# EAGLE design WCS MK2 v3 (EAGLE 7.5.0)
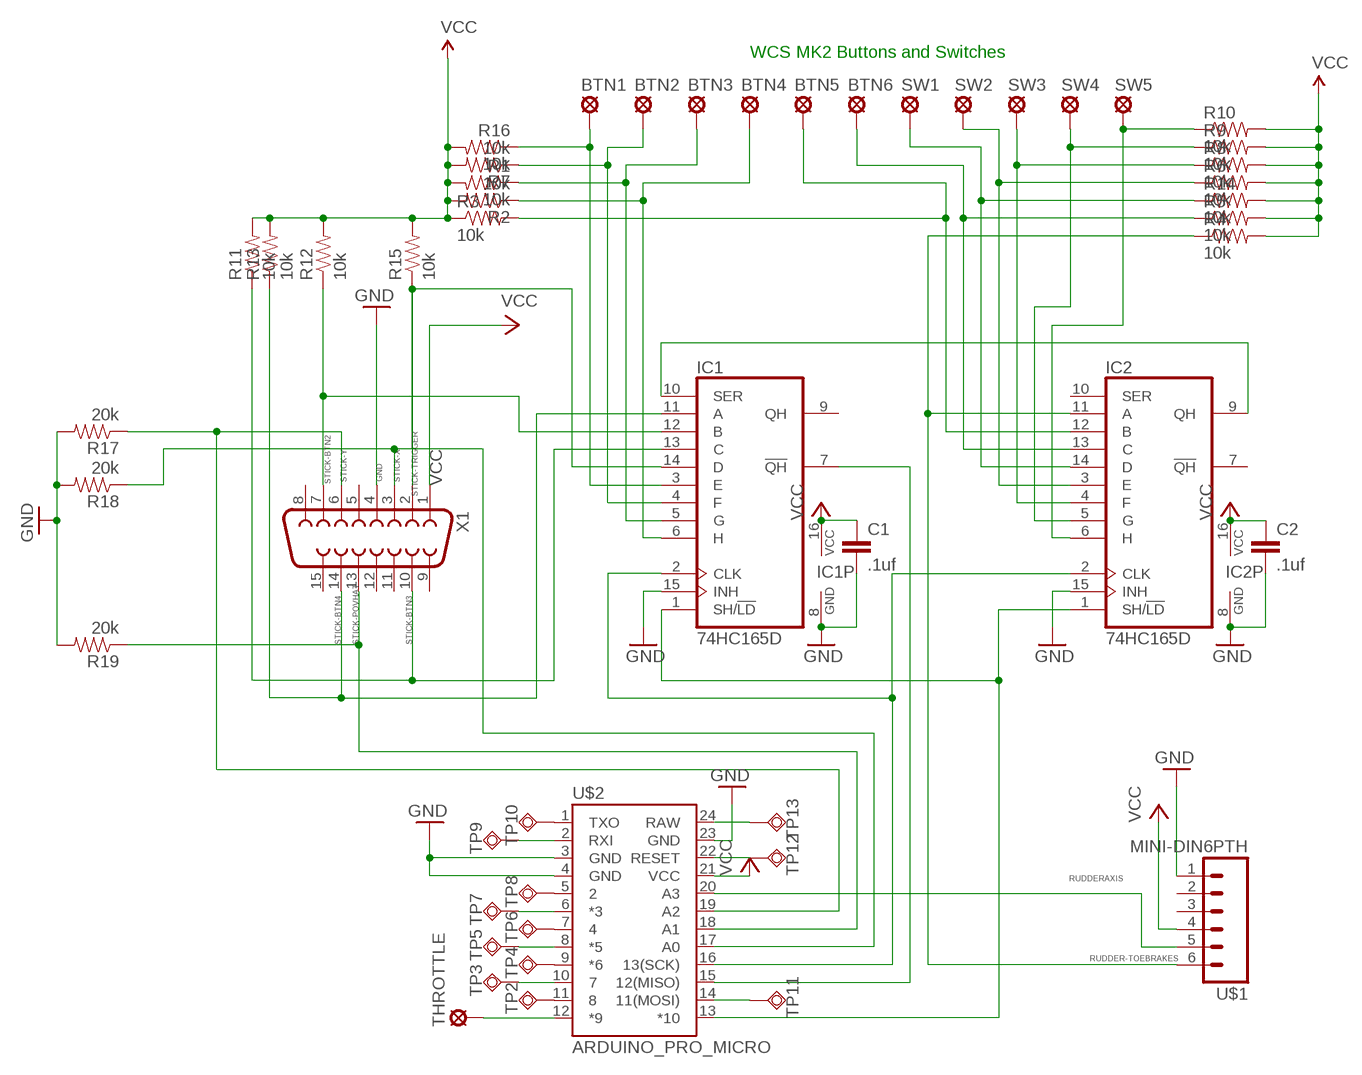
[diagram p0: schematic, sheet 1]

## Parts
BTN1  LSP10  [LSP10]
BTN2  LSP10  [LSP10]
BTN3  LSP10  [LSP10]
BTN4  LSP10  [LSP10]
BTN5  LSP10  [LSP10]
BTN6  LSP10  [LSP10]
C1  .1uf  C-EU025-060X050  [C025-060X050]
C2  .1uf  C-EU025-060X050  [C025-060X050]
IC1  74HC165D  [SO16]
IC2  74HC165D  [SO16]
R1  10k  10KOHM-1/4W5%(PTH)VERT  [AXIAL-0.1]
R2  10k  10KOHM-1/4W5%(PTH)VERT  [AXIAL-0.1]
R3  10k  10KOHM-1/4W5%(PTH)VERT  [AXIAL-0.1]
R4  10k  10KOHM-1/4W5%(PTH)VERT  [AXIAL-0.1]
R5  10k  10KOHM-1/4W5%(PTH)VERT  [AXIAL-0.1]
R6  10k  10KOHM-1/4W5%(PTH)VERT  [AXIAL-0.1]
R7  10k  10KOHM-1/4W5%(PTH)VERT  [AXIAL-0.1]
R8  10k  10KOHM-1/4W5%(PTH)VERT  [AXIAL-0.1]
R9  10k  10KOHM-1/4W5%(PTH)VERT  [AXIAL-0.1]
R10  10k  10KOHM-1/4W5%(PTH)VERT  [AXIAL-0.1]
R11  10k  10KOHM-1/4W5%(PTH)VERT  [AXIAL-0.1]
R12  10k  10KOHM-1/4W5%(PTH)VERT  [AXIAL-0.1]
R13  10k  10KOHM-1/4W5%(PTH)VERT  [AXIAL-0.1]
R14  10k  10KOHM-1/4W5%(PTH)VERT  [AXIAL-0.1]
R15  10k  10KOHM-1/4W5%(PTH)VERT  [AXIAL-0.1]
R16  10k  10KOHM-1/4W5%(PTH)VERT  [AXIAL-0.1]
R17  20k  10KOHM-1/4W5%(PTH)VERT  [AXIAL-0.1]
R18  20k  10KOHM-1/4W5%(PTH)VERT  [AXIAL-0.1]
R19  20k  10KOHM-1/4W5%(PTH)VERT  [AXIAL-0.1]
SW1  LSP10  [LSP10]
SW2  LSP10  [LSP10]
SW3  LSP10  [LSP10]
SW4  LSP10  [LSP10]
SW5  LSP10  [LSP10]
THROTTLE  LSP10  [LSP10]
TP2  TPSQTP20SQ  [TP20SQ]
TP3  TPSQTP20SQ  [TP20SQ]
TP4  TPSQTP20SQ  [TP20SQ]
TP5  TPSQTP20SQ  [TP20SQ]
TP6  TPSQTP20SQ  [TP20SQ]
TP7  TPSQTP20SQ  [TP20SQ]
TP8  TPSQTP20SQ  [TP20SQ]
TP9  TPSQTP20SQ  [TP20SQ]
TP10  TPSQTP20SQ  [TP20SQ]
TP11  TPSQTP20SQ  [TP20SQ]
TP12  TPSQTP20SQ  [TP20SQ]
TP13  TPSQTP20SQ  [TP20SQ]
U$1  MINI-DIN6PTH  [MINI-DIN6]
U$2  ARDUINO_PRO_MICRO  [ARDUINO_PRO_MICRO]
X1  F15HP  [F15HP]

## Nets
CLOCK: IC1.2(CLK) IC2.2(CLK) U$2.16(13(SCK))
DAISYCHAIN: IC1.10(SER) IC2.9(QH)
GND: C1.2 C2.2 IC1.8(GND) IC1.15(INH) IC2.8(GND) IC2.15(INH) R17.P$2 R18.P$2 R19.P$2 U$1.1 U$2.3(GND) U$2.4(GND) U$2.23(GND) X1.4
MISO: IC1.7(!QH) U$2.15(12(MISO))
N$13: BTN1.MP IC1.3(E) R16.P$1
N$14: BTN2.MP IC1.4(F) R7.P$1
N$15: BTN3.MP IC1.5(G) R1.P$1
N$16: BTN4.MP IC1.6(H) R2.P$1
N$17: IC2.6(H) R10.P$1 SW5.MP
N$18: IC2.5(G) R9.P$1 SW4.MP
N$19: IC2.4(F) R8.P$1 SW3.MP
N$20: IC2.3(E) R6.P$1 SW2.MP
N$21: IC2.14(D) R14.P$1 SW1.MP
N$22: BTN6.MP IC2.13(C) R5.P$1
N$23: BTN5.MP IC2.12(B) R3.P$2
N$28: TP2.TP U$2.11
N$29: TP3.TP U$2.10
N$30: TP4.TP U$2.9(*6)
N$31: TP5.TP U$2.8(*5)
N$32: TP6.TP U$2.7
N$33: TP7.TP U$2.6(*3)
N$34: TP8.TP U$2.5
N$35: TP9.TP U$2.2(RXI)
N$36: TP10.TP U$2.1(TXO)
N$37: TP11.TP U$2.14(11(MOSI))
N$38: TP12.TP U$2.22(RESET)
N$39: TP13.TP U$2.24(RAW)
RUDDER-TOEBRAKES: IC2.11(A) R4.P$1 U$1.6
RUDDERAXIS: U$1.5 U$2.20(A3)
SR-LOAD: IC1.1(SH/!LD) IC2.1(SH/!LD) U$2.13(*10)
STICK-BTN2: IC1.12(B) R12.P$1 X1.7
STICK-BTN3: IC1.13(C) R11.P$1 X1.10
STICK-BTN4: IC1.11(A) R13.P$1 X1.14
STICK-POVHAT: R19.P$1 U$2.18(A1) X1.13
STICK-TRIGGER: IC1.14(D) R15.P$1 X1.2
STICK-X: R18.P$1 U$2.17(A0) X1.3
STICK-Y: R17.P$1 U$2.19(A2) X1.6
THROTTLEAXIS: THROTTLE.MP U$2.12(*9)
VCC: C1.1 C2.1 IC1.16(VCC) IC2.16(VCC) R1.P$2 R2.P$2 R3.P$1 R4.P$2 R5.P$2 R6.P$2 R7.P$2 R8.P$2 R9.P$2 R10.P$2 R11.P$2 R12.P$2 R13.P$2 R14.P$2 R15.P$2 R16.P$2 U$1.4 U$2.21(VCC) X1.1
Unconnected: IC1.9(QH) IC2.7(!QH) IC2.10(SER) U$1.2 U$1.3 X1.5 X1.8 X1.9 X1.11 X1.12 X1.15

## Notes on the sheet
- WCS MK2 Buttons and Switches

## Library data of the parts
BTN1-BTN6 SW1-SW5 THROTTLE = solpad:LSP10: SOLDER PAD drill 1.0 mm, distributor Buerklin, 12H555
C1 C2 = resistor:C-EU: CAPACITOR, European symbol
IC1 IC2 = 74xx-eu:74*165: 8-bit parallel load SHIFT REGISTER
R1-R16 = SparkFun-Resistors:10KOHM-1/4W5%(PTH): RES-09435; PROD_ID: RES-9435
R17-R19 = SparkFun-Resistors:10KOHM-1/4W5%(PTH): RES-09435; PROD_ID: RES-9435; VALUE: 10k
TP2-TP13 = testpad:TPSQ: Test pad
U$1 = SparkFun-Connectors:MINI-DIN6: mini DIN 6 Connector Commonly found on the back of a computer for PS2 keyboard and mice. Schematic and footprint are proven. Spark Fun Electronics SKU : PRT-08509
U$2 = SparkFun-Boards:ARDUINO_PRO_MICRO
X1 = con-subd:F15: SUB-D; OC_FARNELL: unknown; OC_NEWARK: unknown

## Board
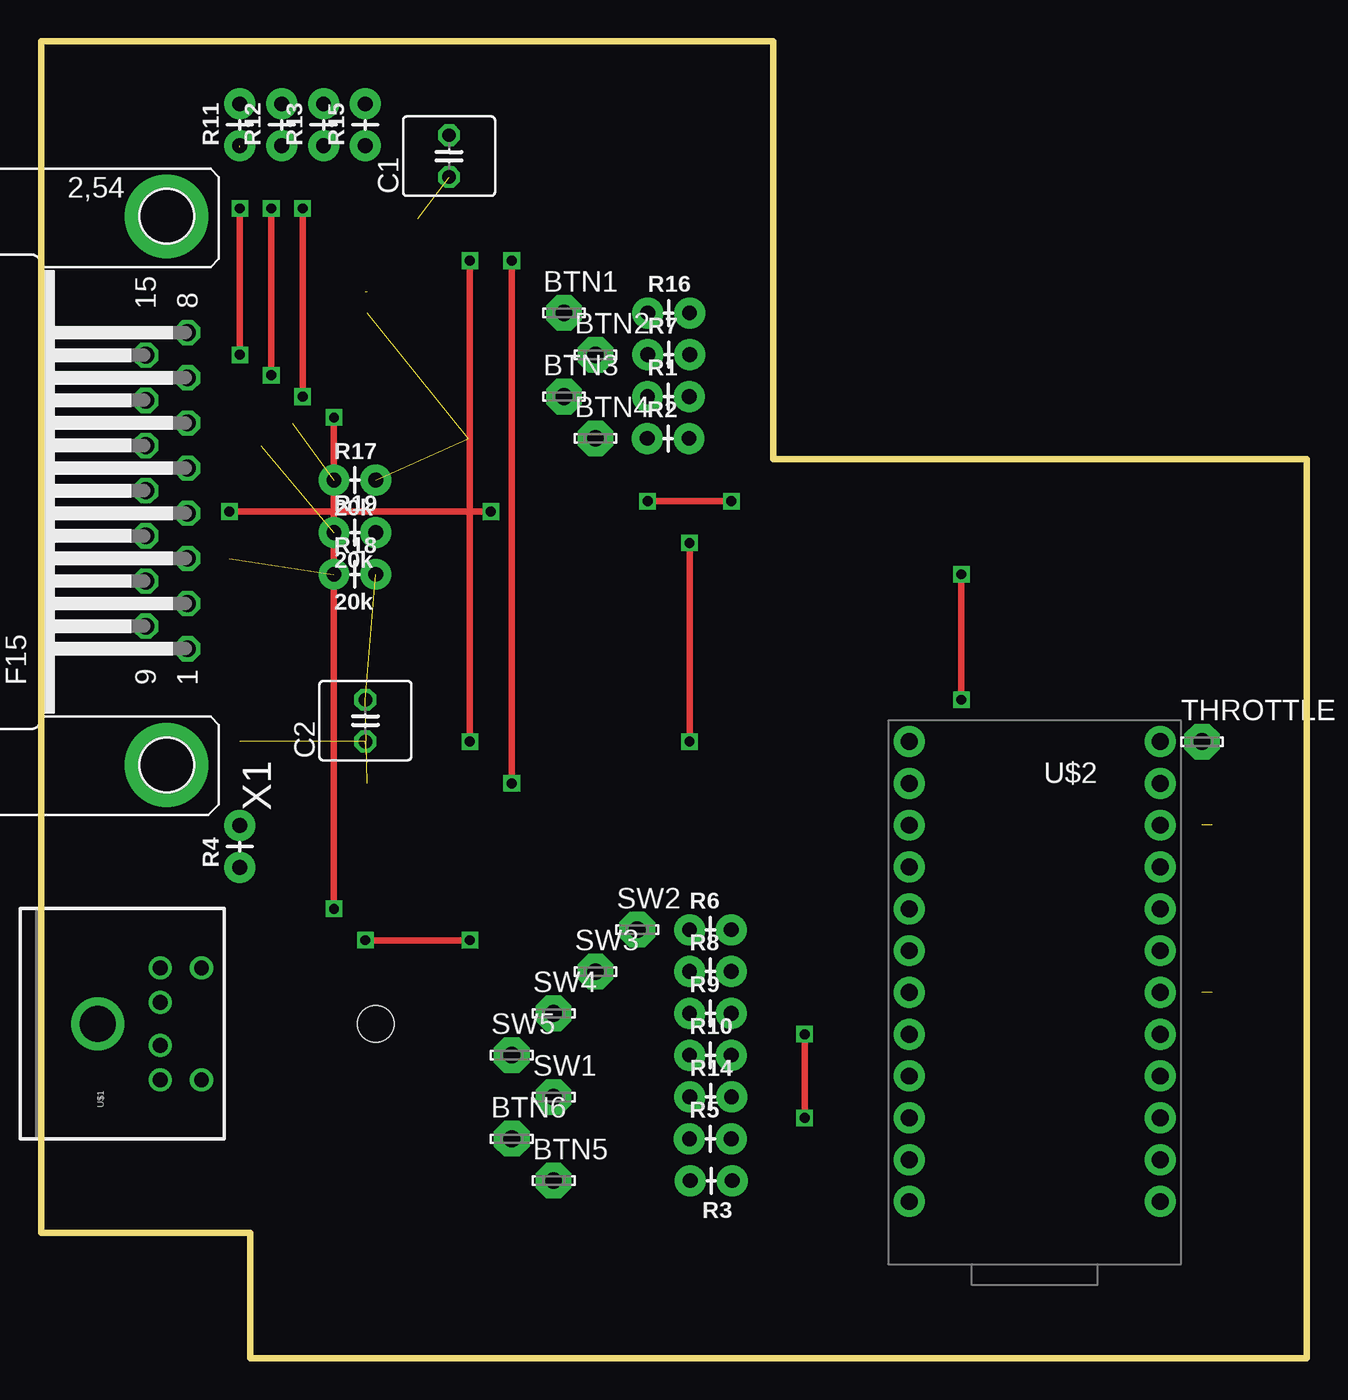
[diagram p1: board, top side]
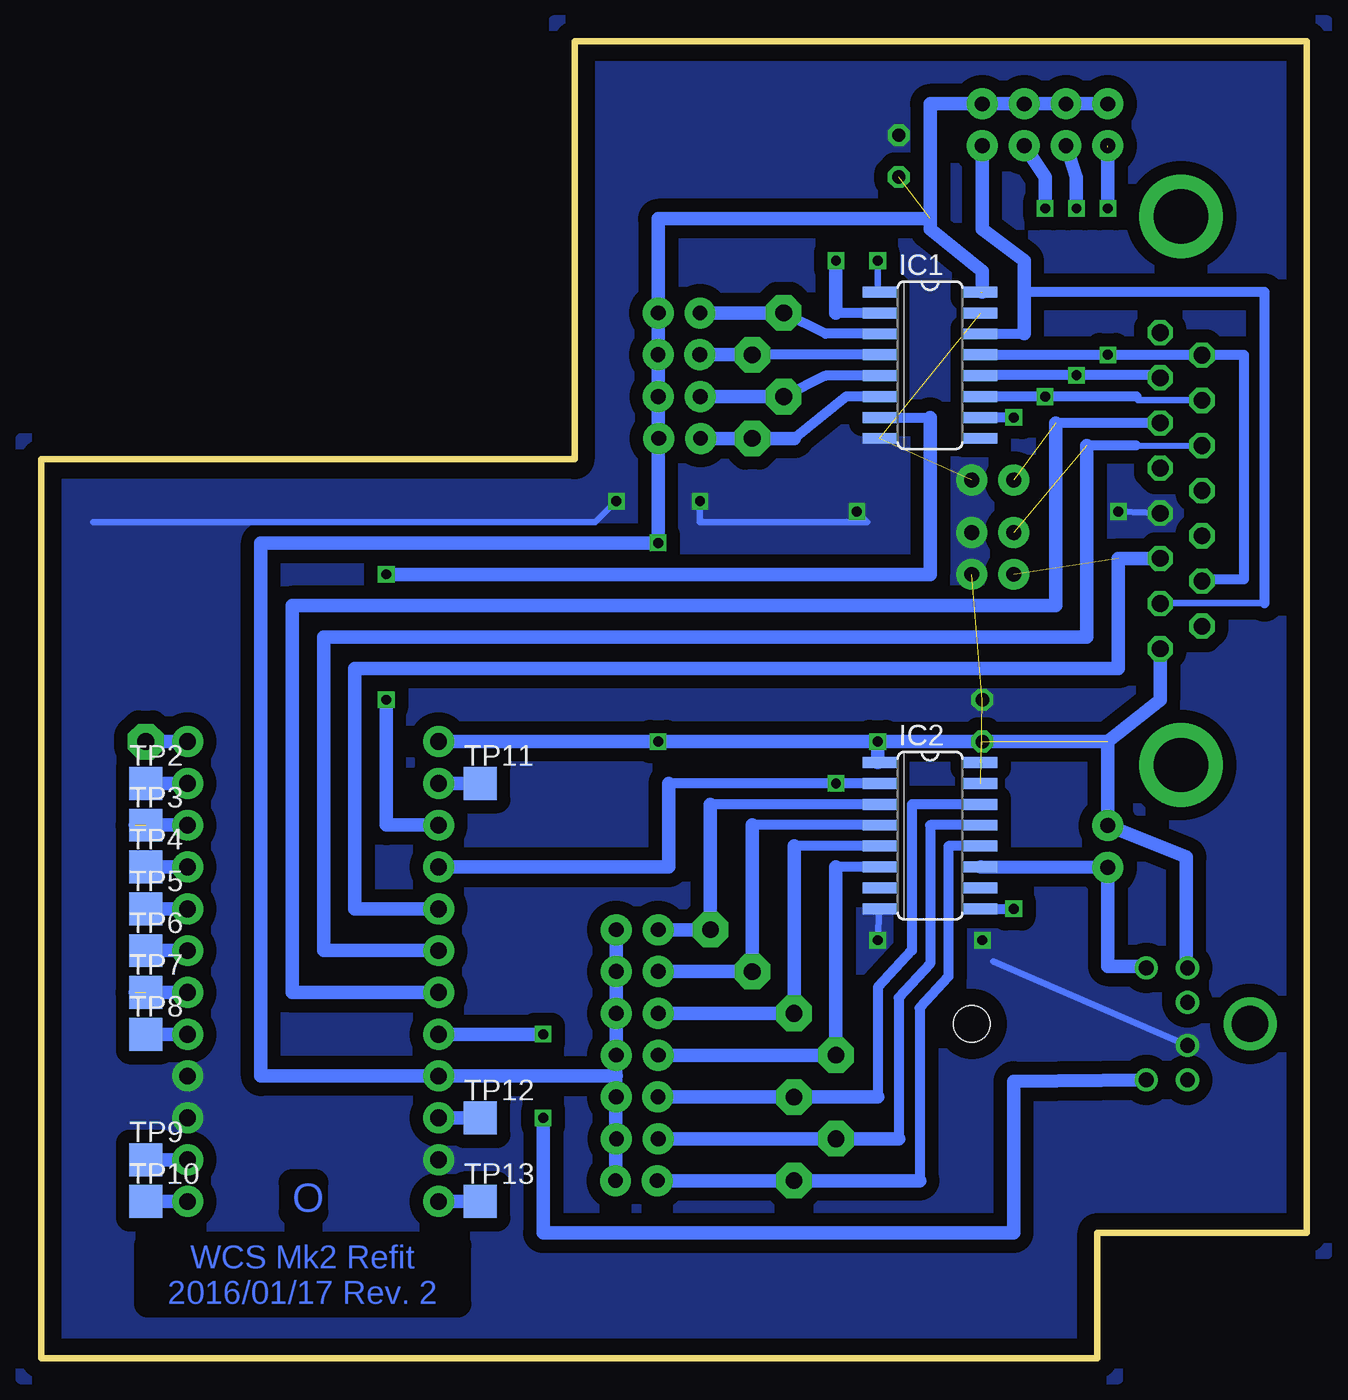
[diagram p2: board, bottom side, seen from below]

Size 76.83 x 80.01 mm. Coordinates in mm from the lower left corner, seen from the top.
Outline: 12.7,0 12.7,7.62 0,7.62 0,80.01 44.45,80.01 44.45,54.61 76.83,54.61 76.83,0 12.7,0
Copper layers (1*16): Top 0.035mm / dielectric 1.5mm / Bottom 0.035mm
Design rules "default": minimum track width 10mil, minimum drill 24mil, track to track 8mil, track to pad 8mil, pad to pad 8mil, via to via 8mil, smd to smd 8mil, copper to edge 40mil, drill to drill 8mil, minimum pad ring 10mil, minimum via ring 8mil, stop-mask expansion 4mil, vias tented up to drill 0mil, thermal gap 10mil
Holes 2.2 mm at 20.32,20.32

### Footprints (pad centres in the part's own frame; a part is rotated, then mirrored left to right if it is on the bottom)
LSP10 = drill 1.016 pad 2.159 octagon: MP 0,0
C025-060X050 = drill 0.813 octagon: 1 -1.27,0; 2 1.27,0
SO16 = smd 0.66 x 2.032: 1 -4.445,-3.073; 2 -3.175,-3.073; 3 -1.905,-3.073; 4 -0.635,-3.073; 5 0.635,-3.073; 6 1.905,-3.073; 7 3.175,-3.073; 8 4.445,-3.073; 9 4.445,3.073; 10 3.175,3.073; 11 1.905,3.073; 12 0.635,3.073; 13 -0.635,3.073; 14 -1.905,3.073; 15 -3.175,3.073; 16 -4.445,3.073
AXIAL-0.1 = drill 0.9 pad 1.88: P$1 0,0; P$2 2.54,0
TP20SQ = smd 2 x 2: TP 0,0
MINI-DIN6 = drill 0.9: 1 -1.3,-8.5; 2 1.3,-8.5; 3 -3.4,-8.5; 4 3.4,-8.5; 5 -3.4,-11; 6 3.4,-11 | drill 2.2: P$1 0,-4.7
ARDUINO_PRO_MICRO = drill 1.016 pad 1.88: 1 -7.62,12.7; 2 -7.62,10.16; 3 -7.62,7.62; 4 -7.62,5.08; 5 -7.62,2.54; 6 -7.62,0; 7 -7.62,-2.54; 8 -7.62,-5.08; 9 -7.62,-7.62; 10 -7.62,-10.16; 11 -7.62,-12.7; 12 -7.62,-15.24; 13 7.62,-15.24; 14 7.62,-12.7; 15 7.62,-10.16; 16 7.62,-7.62; 17 7.62,-5.08; 18 7.62,-2.54; 19 7.62,0; 20 7.62,2.54; 21 7.62,5.08; 22 7.62,7.62; 23 7.62,10.16; 24 7.62,12.7
F15HP = drill 1.016 octagon: 1 -9.601,-1.27; 2 -6.858,-1.27; 3 -4.115,-1.27; 4 -1.372,-1.27; 5 1.372,-1.27; 6 4.115,-1.27; 7 6.858,-1.27; 8 9.601,-1.27; 9 -8.23,1.27; 10 -5.486,1.27; 11 -2.743,1.27; 12 0,1.27; 13 2.743,1.27; 14 5.486,1.27; 15 8.23,1.27 | drill 3.302 pad 5.08: G1 -16.662,0; G2 16.662,0

### Placement (x,y rotation side)
BTN1  31.75,63.5 0 top
BTN2  33.66,60.96 0 top
BTN3  31.75,58.42 0 top
BTN4  33.66,55.88 0 top
BTN5  31.11,10.79 0 top
BTN6  28.57,13.34 0 top
C1  24.77,73.03 90 top
C2  19.68,38.73 90 top
IC1  22.86,60.33 270 bottom
IC2  22.86,31.75 270 bottom
R1  36.82,58.42 0 top
R2  36.8,55.88 0 top
R3  41.96,10.79 180 top
R4  12.06,29.82 90 top
R5  39.36,13.34 0 top
R6  39.37,26.04 0 top
R7  36.84,60.96 0 top
R8  39.37,23.5 0 top
R9  39.37,20.95 0 top
R10  39.37,18.41 0 top
R11  12.06,73.66 90 top
R12  14.61,73.66 90 top
R13  17.14,73.66 90 top
R14  39.38,15.88 0 top
R15  19.68,73.66 90 top
R16  36.83,63.5 0 top
R17  17.78,53.34 0 top
R18  17.78,47.62 0 top
R19  17.78,50.16 0 top
SW1  31.11,15.88 0 top
SW2  36.2,26.04 0 top
SW3  33.66,23.5 0 top
SW4  31.11,20.95 0 top
SW5  28.57,18.41 0 top
THROTTLE  70.48,37.47 0 top
TP2  70.48,34.92 0 bottom
TP3  70.48,32.38 0 bottom
TP4  70.48,29.84 0 bottom
TP5  70.48,27.3 0 bottom
TP6  70.48,24.77 0 bottom
TP7  70.48,22.23 0 bottom
TP8  70.48,19.68 0 bottom
TP9  70.48,12.06 0 bottom
TP10  70.48,9.53 0 bottom
TP11  50.16,34.92 0 bottom
TP12  50.16,14.61 0 bottom
TP13  50.16,9.53 0 bottom
U$1  -1.27,20.32 90 top
U$2  60.33,22.23 180 top
X1  7.62,52.7 90 top

### Tracks (layer width: path | path; a pad name or v marks a point on that pad's centre or on a via)
CLOCK  (via drill 0.6)
  Top 0.406: v28.57,34.92 v28.57,66.67
  Bottom 0.61: IC2.2 v28.57,34.92 38.73,34.92 | IC1.2 28.57,63.5
  Bottom 0.813: U$2.16 38.73,29.84 38.73,34.92 | 28.57,63.5 v28.57,66.67
DAISYCHAIN  (via drill 0.6)
  Top 0.406: v17.78,27.3 v17.78,57.15
  Bottom 0.61: IC2.9 v17.78,27.3 | v17.78,57.15 IC1.10
GND  (via drill 0.6)  (4 unrouted)
  Top 0.406: v11.43,51.44 v27.3,51.44 | v26.04,25.4 v19.68,25.4 | v36.83,52.07 v41.91,52.07
  Bottom 0.406: X1.4 v11.43,51.44 | IC2.8 v26.04,25.4 | 19.02,24.1 U$1.1 | v27.3,51.44 26.67,50.8 36.83,50.8 v36.83,52.07 | v41.91,52.07 43.18,50.8 73.66,50.8
  pour Bottom (isolate 0.813, rank 6, no thermals): -1.27,6.35 -1.27,81.28 45.72,81.28 45.72,55.88 78.11,55.88 78.11,-1.27 11.43,-1.27 11.43,6.35
MISO  (via drill 0.6)
  Top 0.406: v55.88,40.01 v55.88,47.62
  Bottom 0.61: IC1.7 22.86,57.15
  Bottom 0.813: 22.86,57.15 22.86,47.62 v55.88,47.62 | U$2.15 55.88,32.38 v55.88,40.01
N$13
  Bottom 0.61: IC1.3 29.21,62.23 BTN1.MP
  Bottom 0.813: BTN1.MP R16.P$1
N$14
  Bottom 0.61: IC1.4 BTN2.MP
  Bottom 0.813: BTN2.MP R7.P$1
N$15
  Bottom 0.406: 36.67,58.42 R1.P$1
  Bottom 0.61: IC1.5 29.21,59.69 BTN3.MP
  Bottom 0.813: BTN3.MP 36.67,58.42
N$16
  Bottom 0.61: IC1.6 27.94,58.42 31.11,55.88
  Bottom 0.813: R2.P$1 BTN4.MP 31.11,55.88
N$17
  Bottom 0.61: IC2.6 28.57,29.84
  Bottom 0.813: 28.57,29.84 SW5.MP R10.P$1
N$18
  Bottom 0.61: IC2.5 31.11,31.11
  Bottom 0.813: 31.11,31.11 SW4.MP R9.P$1
N$19
  Bottom 0.61: IC2.4 33.66,32.38
  Bottom 0.813: 33.66,32.38 SW3.MP R8.P$1
N$20
  Bottom 0.61: IC2.3 36.2,33.66
  Bottom 0.813: 36.2,33.66 SW2.MP R6.P$1
N$21
  Bottom 0.61: IC2.14 23.97,33.66 23.97,24.77 26.04,22.54 26.04,15.88
  Bottom 0.813: 26.04,15.88 SW1.MP R14.P$1
N$22
  Bottom 0.61: IC2.13 22.86,32.38 22.86,23.97 24.77,21.91 24.77,13.34
  Bottom 0.813: 24.77,13.34 BTN6.MP R5.P$1
N$23
  Bottom 0.61: IC2.12 21.75,31.11 21.75,23.18 23.5,21.27 23.5,10.79
  Bottom 0.813: 23.5,10.79 BTN5.MP R3.P$2
N$28
  Bottom 0.406: U$2.11 TP2.TP
  Bottom 0.813: U$2.11 TP2.TP
N$29  (1 unrouted)
  Bottom 0.813: U$2.10 71.12,32.38
N$30
  Bottom 0.813: U$2.9 TP4.TP
N$31
  Bottom 0.813: U$2.8 TP5.TP
N$32
  Bottom 0.813: U$2.7 TP6.TP
N$33  (1 unrouted)
  Bottom 0.406: 71.12,22.23 71.12,21.59
  Bottom 0.813: U$2.6 71.12,22.23
N$34
  Bottom 0.813: U$2.5 TP8.TP
N$35
  Bottom 0.813: U$2.2 TP9.TP
N$36
  Bottom 0.813: U$2.1 TP10.TP
N$37
  Bottom 0.813: U$2.14 TP11.TP
N$38
  Bottom 0.813: U$2.22 TP12.TP
N$39
  Bottom 0.813: TP13.TP U$2.24
RUDDER-TOEBRAKES
  Bottom 0.406: 12.06,27.3 R4.P$1 12.09,27.33 | 9.84,23.81 U$1.6
  Bottom 0.813: 9.84,23.81 12.06,23.81 R4.P$1 IC2.11
RUDDERAXIS  (via drill 0.6)
  Top 0.406: v46.35,19.68 v46.35,14.61
  Bottom 0.813: U$2.20 v46.35,19.68 | v46.35,14.61 46.35,7.62 17.78,7.62 17.78,16.83 U$1.5
SR-LOAD  (via drill 0.6)
  Top 0.406: v26.04,37.47 v26.04,66.67
  Bottom 0.406: IC1.1 26.04,64.77 v26.04,66.67 | IC2.1 26.04,36.2
  Bottom 0.813: 26.04,36.2 v26.04,37.47 U$2.13
STICK-BTN2  (via drill 0.6)
  Top 0.406: v13.97,69.85 v13.97,59.72
  Bottom 0.406: X1.7 8.89,59.69 8.92,59.72 | 19.79,59.72 IC1.12
  Bottom 0.61: 8.92,59.72 v13.97,59.72 19.79,59.72
  Bottom 0.813: v13.97,69.85 13.97,71.75 R12.P$1
STICK-BTN3  (via drill 0.6)  (1 unrouted)
  Top 0.406: v12.06,69.85 v12.06,60.96
  Bottom 0.406: 6.26,47.31 X1.10
  Bottom 0.61: IC1.13 v12.06,60.96 10.32,60.96 3.81,60.96 3.81,47.31 6.26,47.31
  Bottom 0.813: 12.06,73.56 v12.06,69.85
STICK-BTN4  (via drill 0.6)
  Top 0.406: v15.88,69.85 v15.88,58.42
  Bottom 0.406: X1.14 10.25,58.19 10.32,58.42 | 15.7,58.42 v15.88,58.42
  Bottom 0.61: 10.32,58.42 v15.88,58.42 IC1.11
  Bottom 0.813: v15.88,69.85 15.88,71.75 R13.P$1
STICK-POVHAT  (1 unrouted)
  Bottom 0.406: X1.13 10.32,55.4 10.36,55.45
  Bottom 0.61: 10.36,55.45 13.34,55.45
  Bottom 0.813: 13.34,55.45 13.34,43.81 59.69,43.81 59.69,24.77 U$2.18
STICK-TRIGGER
  Bottom 0.406: 2.54,45.88 8.89,45.88 X1.2
  Bottom 0.61: 2.54,45.88 2.54,64.77 17.14,64.77 | IC1.14 17.14,62.23
  Bottom 0.813: 17.14,62.23 17.14,64.77 17.14,66.67 19.68,68.58 R15.P$1
STICK-X  (1 unrouted)
  Bottom 0.813: X1.3 11.43,48.59 11.43,41.91 57.78,41.91 57.78,27.3 U$2.17
STICK-Y  (1 unrouted)
  Bottom 0.61: X1.6 15.24,56.82
  Bottom 0.813: 15.24,56.82 15.24,45.72 61.59,45.72 61.59,22.23 U$2.19
THROTTLEAXIS
  Bottom 0.813: THROTTLE.MP U$2.12
VCC  (via drill 0.6)  (4 unrouted)
  Top 0.406: v39.37,37.47 v39.37,49.53
  Bottom 0.406: 39.36,54.61 R2.P$2 39.37,54.61 | R1.P$2 39.36,57.94 | R7.P$2 | U$1.4 7.3,23.72 | 41.91,17.14 R10.P$2 41.96,18.36 | 41.96,15.88 R14.P$2 41.91,17.14 | 41.91,17.14 41.9,17.14 R5.P$2
  Bottom 0.813: v39.37,37.47 12.06,37.47 | 39.36,54.61 R1.P$2 | 39.36,57.94 R7.P$2 | R7.P$2 R16.P$2 39.37,69.22 22.86,69.22 | 19.68,64.77 19.68,66.04 22.86,68.58 22.86,69.22 | 22.86,69.22 22.86,76.2 R15.P$2 R13.P$2 R12.P$2 R11.P$2 | X1.1 8.89,40.01 12.06,37.47 | 12.06,37.47 R4.P$2 7.3,30.45 7.3,23.72 | 39.37,54.61 v39.37,49.53 63.5,49.53 63.5,17.14 U$2.21 41.91,17.14 | 41.96,18.36 41.96,15.88 R3.P$1 | R6.P$2 R8.P$2 R9.P$2 R10.P$2

### Text on the board
Bottom: O | WCS Mk2 Refit / 2016/01/17 Rev. 2